# Altium schematic sheet 单片机频谱显示.SchDoc
size A3
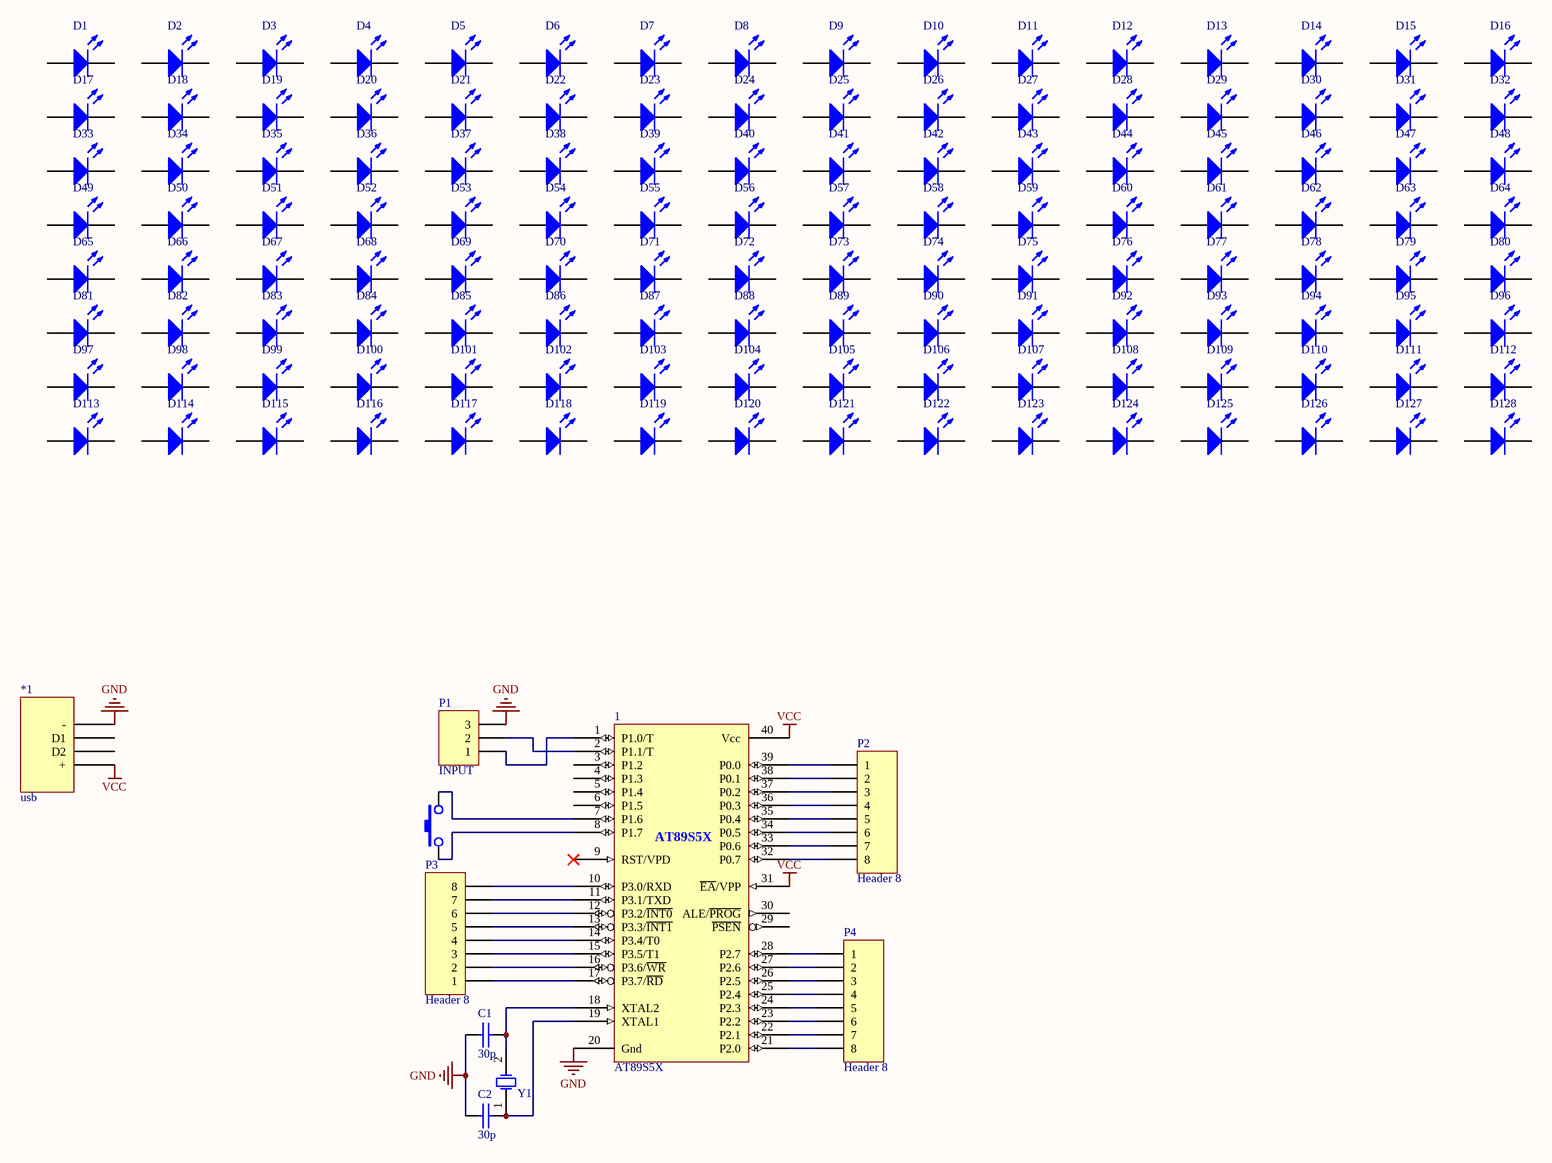
[diagram p0: 单片机频谱显示.SchDoc]

## Parts
1  AT89S5X  [DIP-40]
*1  usb  [USB]
C1  value 30p  [RAD0.2]  (hidden comment: CAP)
C2  value 30p  [RAD0.2]  (hidden comment: CAP)
D1  LED0  [LED]  (value not drawn)
D2  LED0  [LED]  (value not drawn)
D3  LED0  [LED]  (value not drawn)
D4  LED0  [LED]  (value not drawn)
D5  LED0  [LED]  (value not drawn)
D6  LED0  [LED]  (value not drawn)
D7  LED0  [LED]  (value not drawn)
D8  LED0  [LED]  (value not drawn)
D9  LED0  [LED]  (value not drawn)
D10  LED0  [LED]  (value not drawn)
D11  LED0  [LED]  (value not drawn)
D12  LED0  [LED]  (value not drawn)
D13  LED0  [LED]  (value not drawn)
D14  LED0  [LED]  (value not drawn)
D15  LED0  [LED]  (value not drawn)
D16  LED0  [LED]  (value not drawn)
D17  LED0  [LED]  (value not drawn)
D18  LED0  [LED]  (value not drawn)
D19  LED0  [LED]  (value not drawn)
D20  LED0  [LED]  (value not drawn)
D21  LED0  [LED]  (value not drawn)
D22  LED0  [LED]  (value not drawn)
D23  LED0  [LED]  (value not drawn)
D24  LED0  [LED]  (value not drawn)
D25  LED0  [LED]  (value not drawn)
D26  LED0  [LED]  (value not drawn)
D27  LED0  [LED]  (value not drawn)
D28  LED0  [LED]  (value not drawn)
D29  LED0  [LED]  (value not drawn)
D30  LED0  [LED]  (value not drawn)
D31  LED0  [LED]  (value not drawn)
D32  LED0  [LED]  (value not drawn)
D33  LED0  [LED]  (value not drawn)
D34  LED0  [LED]  (value not drawn)
D35  LED0  [LED]  (value not drawn)
D36  LED0  [LED]  (value not drawn)
D37  LED0  [LED]  (value not drawn)
D38  LED0  [LED]  (value not drawn)
D39  LED0  [LED]  (value not drawn)
D40  LED0  [LED]  (value not drawn)
D41  LED0  [LED]  (value not drawn)
D42  LED0  [LED]  (value not drawn)
D43  LED0  [LED]  (value not drawn)
D44  LED0  [LED]  (value not drawn)
D45  LED0  [LED]  (value not drawn)
D46  LED0  [LED]  (value not drawn)
D47  LED0  [LED]  (value not drawn)
D48  LED0  [LED]  (value not drawn)
D49  LED0  [LED]  (value not drawn)
D50  LED0  [LED]  (value not drawn)
D51  LED0  [LED]  (value not drawn)
D52  LED0  [LED]  (value not drawn)
D53  LED0  [LED]  (value not drawn)
D54  LED0  [LED]  (value not drawn)
D55  LED0  [LED]  (value not drawn)
D56  LED0  [LED]  (value not drawn)
D57  LED0  [LED]  (value not drawn)
D58  LED0  [LED]  (value not drawn)
D59  LED0  [LED]  (value not drawn)
D60  LED0  [LED]  (value not drawn)
D61  LED0  [LED]  (value not drawn)
D62  LED0  [LED]  (value not drawn)
D63  LED0  [LED]  (value not drawn)
D64  LED0  [LED]  (value not drawn)
D65  LED0  [LED]  (value not drawn)
D66  LED0  [LED]  (value not drawn)
D67  LED0  [LED]  (value not drawn)
D68  LED0  [LED]  (value not drawn)
D69  LED0  [LED]  (value not drawn)
D70  LED0  [LED]  (value not drawn)
D71  LED0  [LED]  (value not drawn)
D72  LED0  [LED]  (value not drawn)
D73  LED0  [LED]  (value not drawn)
D74  LED0  [LED]  (value not drawn)
D75  LED0  [LED]  (value not drawn)
D76  LED0  [LED]  (value not drawn)
D77  LED0  [LED]  (value not drawn)
D78  LED0  [LED]  (value not drawn)
D79  LED0  [LED]  (value not drawn)
D80  LED0  [LED]  (value not drawn)
D81  LED0  [LED]  (value not drawn)
D82  LED0  [LED]  (value not drawn)
D83  LED0  [LED]  (value not drawn)
D84  LED0  [LED]  (value not drawn)
D85  LED0  [LED]  (value not drawn)
D86  LED0  [LED]  (value not drawn)
D87  LED0  [LED]  (value not drawn)
D88  LED0  [LED]  (value not drawn)
D89  LED0  [LED]  (value not drawn)
D90  LED0  [LED]  (value not drawn)
D91  LED0  [LED]  (value not drawn)
D92  LED0  [LED]  (value not drawn)
D93  LED0  [LED]  (value not drawn)
D94  LED0  [LED]  (value not drawn)
D95  LED0  [LED]  (value not drawn)
D96  LED0  [LED]  (value not drawn)
D97  LED0  [LED]  (value not drawn)
D98  LED0  [LED]  (value not drawn)
D99  LED0  [LED]  (value not drawn)
D100  LED0  [LED]  (value not drawn)
D101  LED0  [LED]  (value not drawn)
D102  LED0  [LED]  (value not drawn)
D103  LED0  [LED]  (value not drawn)
D104  LED0  [LED]  (value not drawn)
D105  LED0  [LED]  (value not drawn)
D106  LED0  [LED]  (value not drawn)
D107  LED0  [LED]  (value not drawn)
D108  LED0  [LED]  (value not drawn)
D109  LED0  [LED]  (value not drawn)
D110  LED0  [LED]  (value not drawn)
D111  LED0  [LED]  (value not drawn)
D112  LED0  [LED]  (value not drawn)
D113  LED0  [LED]  (value not drawn)
D114  LED0  [LED]  (value not drawn)
D115  LED0  [LED]  (value not drawn)
D116  LED0  [LED]  (value not drawn)
D117  LED0  [LED]  (value not drawn)
D118  LED0  [LED]  (value not drawn)
D119  LED0  [LED]  (value not drawn)
D120  LED0  [LED]  (value not drawn)
D121  LED0  [LED]  (value not drawn)
D122  LED0  [LED]  (value not drawn)
D123  LED0  [LED]  (value not drawn)
D124  LED0  [LED]  (value not drawn)
D125  LED0  [LED]  (value not drawn)
D126  LED0  [LED]  (value not drawn)
D127  LED0  [LED]  (value not drawn)
D128  LED0  [LED]  (value not drawn)
key1  KEY  [KeyA]  (value not drawn)
P1  INPUT  [HDR1X3]
P2  Header 8  [HDR1X8]
P3  Header 8  [HDR1X8]
P4  Header 8  [HDR1X8]
Y1  XTAL  [XTAL]  (value not drawn)

## Nets
GND: 1.20(Gnd) *1.- C1.1 C2.1 P1.3
VCC: 1.31(~{EA}/VPP) 1.40(Vcc) *1.+
Net1_1: 1.1(P1.0/T) P1.1
Net1_2: 1.2(P1.1/T) P1.2
Net1_7: 1.7(P1.6) key1.2
Net1_8: 1.8(P1.7) key1.1
Net1_10: 1.10(P3.0/RXD) P3.8
Net1_11: 1.11(P3.1/TXD) P3.7
Net1_12: 1.12(P3.2/~{INT0}) P3.6
Net1_13: 1.13(P3.3/~{INT1}) P3.5
Net1_14: 1.14(P3.4/T0) P3.4
Net1_15: 1.15(P3.5/T1) P3.3
Net1_16: 1.16(P3.6/~{WR}) P3.2
Net1_17: 1.17(P3.7/~{RD}) P3.1
Net1_18: 1.18(XTAL2) C1.2 Y1.2(OSC2)
Net1_19: 1.19(XTAL1) C2.2 Y1.1(OSC1)
Net1_21: 1.21(P2.0) P4.8
Net1_22: 1.22(P2.1) P4.7
Net1_23: 1.23(P2.2) P4.6
Net1_24: 1.24(P2.3) P4.5
Net1_25: 1.25(P2.4) P4.4
Net1_26: 1.26(P2.5) P4.3
Net1_27: 1.27(P2.6) P4.2
Net1_28: 1.28(P2.7) P4.1
Net1_32: 1.32(P0.7) P2.8
Net1_33: 1.33(P0.6) P2.7
Net1_34: 1.34(P0.5) P2.6
Net1_35: 1.35(P0.4) P2.5
Net1_36: 1.36(P0.3) P2.4
Net1_37: 1.37(P0.2) P2.3
Net1_38: 1.38(P0.1) P2.2
Net1_39: 1.39(P0.0) P2.1

Not connected (* = marked no-connect by the designer): 1 3(P1.2) 4(P1.3) 5(P1.4) 6(P1.5) 9(RST/VPD)* 29(~{PSEN}) 30(ALE/~{PROG}); *1 D1 D2 NP; D1 1(A) 2(K); D2 1(A) 2(K); D3 1(A) 2(K); D4 1(A) 2(K); D5 1(A) 2(K); D6 1(A) 2(K); D7 1(A) 2(K); D8 1(A) 2(K); D9 1(A) 2(K); D10 1(A) 2(K); D11 1(A) 2(K); D12 1(A) 2(K); D13 1(A) 2(K); D14 1(A) 2(K); D15 1(A) 2(K); D16 1(A) 2(K); D17 1(A) 2(K); D18 1(A) 2(K); D19 1(A) 2(K); D20 1(A) 2(K); D21 1(A) 2(K); D22 1(A) 2(K); D23 1(A) 2(K); D24 1(A) 2(K); D25 1(A) 2(K); D26 1(A) 2(K); D27 1(A) 2(K); D28 1(A) 2(K); D29 1(A) 2(K); D30 1(A) 2(K); D31 1(A) 2(K); D32 1(A) 2(K); D33 1(A) 2(K); D34 1(A) 2(K); D35 1(A) 2(K); D36 1(A) 2(K); D37 1(A) 2(K); D38 1(A) 2(K); D39 1(A) 2(K); D40 1(A) 2(K); D41 1(A) 2(K); D42 1(A) 2(K); D43 1(A) 2(K); D44 1(A) 2(K); D45 1(A) 2(K); D46 1(A) 2(K); D47 1(A) 2(K); D48 1(A) 2(K); D49 1(A) 2(K); D50 1(A) 2(K); D51 1(A) 2(K); D52 1(A) 2(K); D53 1(A) 2(K); D54 1(A) 2(K); D55 1(A) 2(K); D56 1(A) 2(K); D57 1(A) 2(K); D58 1(A) 2(K); D59 1(A) 2(K); D60 1(A) 2(K); D61 1(A) 2(K); D62 1(A) 2(K); D63 1(A) 2(K); D64 1(A) 2(K); D65 1(A) 2(K); D66 1(A) 2(K); D67 1(A) 2(K); D68 1(A) 2(K); D69 1(A) 2(K); D70 1(A) 2(K); D71 1(A) 2(K); D72 1(A) 2(K); D73 1(A) 2(K); D74 1(A) 2(K); D75 1(A) 2(K); D76 1(A) 2(K); D77 1(A) 2(K); D78 1(A) 2(K); D79 1(A) 2(K); D80 1(A) 2(K); D81 1(A) 2(K); D82 1(A) 2(K); D83 1(A) 2(K); D84 1(A) 2(K); D85 1(A) 2(K); D86 1(A) 2(K); D87 1(A) 2(K); D88 1(A) 2(K); D89 1(A) 2(K); D90 1(A) 2(K); D91 1(A) 2(K); D92 1(A) 2(K); D93 1(A) 2(K); D94 1(A) 2(K); D95 1(A) 2(K); D96 1(A) 2(K); D97 1(A) 2(K); D98 1(A) 2(K); D99 1(A) 2(K); D100 1(A) 2(K); D101 1(A) 2(K); D102 1(A) 2(K); D103 1(A) 2(K); D104 1(A) 2(K); D105 1(A) 2(K); D106 1(A) 2(K); D107 1(A) 2(K); D108 1(A) 2(K); D109 1(A) 2(K); D110 1(A) 2(K); D111 1(A) 2(K); D112 1(A) 2(K); D113 1(A) 2(K); D114 1(A) 2(K); D115 1(A) 2(K); D116 1(A) 2(K); D117 1(A) 2(K); D118 1(A) 2(K); D119 1(A) 2(K); D120 1(A) 2(K); D121 1(A) 2(K); D122 1(A) 2(K); D123 1(A) 2(K); D124 1(A) 2(K); D125 1(A) 2(K); D126 1(A) 2(K); D127 1(A) 2(K); D128 1(A) 2(K)

## Library data of the parts
D1-D128 = LED0: Typical INFRARED GaAs LED; Published: 8-Jun-2000; LatestRevisionDate: 08-Jul-2005; LatestRevisionNote: Mech Layer 1 removed.; PackageReference: LED-0; Publisher: Altium Limited; PackageDescription: LED; 2 Leads
P1 = Header 3: Header, 3-Pin; LatestRevisionDate: 17-Jul-2002; LatestRevisionNote: Re-released for DXP Platform.; Publisher: Altium Limited
P2-P4 = Header 8: Header, 8-Pin; LatestRevisionDate: 17-Jul-2002; LatestRevisionNote: Re-released for DXP Platform.; Publisher: Altium Limited
Y1 = XTAL: Crystal Oscillator; Published: 8-Jun-2000; Revision: July-2002: Re-released for DXP Platform.; Publisher: Altium Limited